# Altium schematic sheet USRP.SchDoc
size A
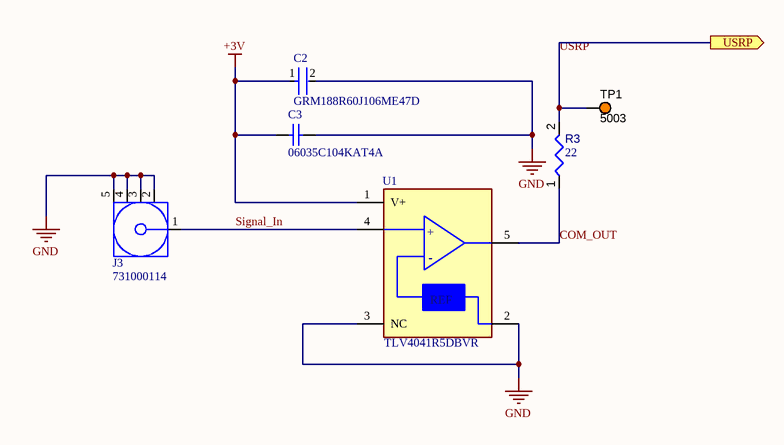
[diagram p0: USRP.SchDoc]

## Parts
C2  GRM188R60J106ME47D  [FP-GRM188-0_1-e0_2_0_55-IPC_A]
C3  06035C104KAT4A  [CAPC1608X90X35LL15T15]
J3  731000114  [MOLX-731000114_V]
R3  value 22  [RESC1609X50X30ML08T20]  (hidden comment: Resistor 22R +/-1% 0603 100 mW)
TP1  5003  [KSTN-5003]
U1  TLV4041R5DBVR  [FP-DBV0005A-IPC_C]

## Ports
USRP (out)

## Nets
+3V: C2.1 C3.2 U1.1(V+)
GND: C2.2 C3.1 J3.2 J3.3 J3.4 J3.5 U1.2(V-) U1.3(NC)
COM_OUT: R3.1 U1.5(OUT)
Signal_In: J3.1 U1.4(IN)
USRP: R3.2 TP1.1 ; port USRP

## Notes on the sheet
- (in symbol CMP-04896-000141-1) +; -; REF

## Library data of the parts
C2 = CMP-2006-02792-2: Chip Multilayer Ceramic Capacitors for General Purpose, 0603, 10uF, X5R, 15%, 20%, 6.3V; Packaging: Tape and Reel; Voltage Rating (DC): 6.3V; Width: 0.031inch; Termination: SMD/SMT; Dielectric: X5R; Package Quantity: 4000; Voltage Rating: 6.3V; Capacitance: 10uF; Case/Package: 0603; Min Operating Temperature: -55°C; Voltage: 6.3V; Length: 1.6mm; Thickness: 0.035inch; Lead Free: Lead Free; Depth: 0.8mm; Case Code (Imperial): 0603; Max Operating Temperature: 85°C; Material: Ceramic; Height: 0.8mm; Tolerance: 20%; Mount: Surface Mount; REACH SVHC: No SVHC; Radiation Hardening: No; Case Code (Metric): 1608
C3 = CMP-2006-04390-1: Manufacturer: AVX Interconnect / Elco; Part Number: 06035C104KAT4A
J3 = CMP-2000-05487-1: SMA Right-Angle PCB Jack Receptacle, Brass Body, Gold Plated, 50 Ohm, 5-Pin THD, RoHS, Tray; Manufacturer: Molex; Datasheet Version: 09/2016; Package Description: 5-Pin Through Hole Device, Body 14.8 x 6.35 mm, Pitch 2.54 mm; Datasheet URL: http://www.molex.com/webdocs/datasheets/pdf/en-us/0731000114_RF_COAX_CONNECTORS.pdf; Manufacturer URL: http://www.molex.com/; Package Reference: 731000114; Mounting Technology: ThroughHole; Package URL: http://www.molex.com/pdm_docs/sd/731000114_sd.pdf
R3 = CMP-009-00027-5: Chip Resistor, 22 Ohm, +/- 1%, 100 mW, -55 to 155 degC, 0603 (1608 Metric); Power: 100mW; Voltage Rating: 75V; Max Operating Temperature: 155°C; Min Operating Temperature: -55°C; Tolerance: 1%; RoHS Compliant: True; Mounting Technology: SM; Case/Package: 0603; Pins: 2
TP1 = CMP-002-00037-2: Test Point, Orange, Height 4.6 mm, Tail Length 3 mm, 1-Pin THD, RoHS; Manufacturer: Keystone; Colour: Orange; Packaging: Bulk; Package Description: 1-Pin Through Hole Device, Dia 2.54 mm; Pins: 1; Package Reference: 5003; Datasheet Version: Jun-15; Case/Package: 5003; Mounting Technology: TH; Connector Type: TestPoint; Diameter: 2.54mm; Contact Material: Bronze; Datasheet URL: http://keyelco.com/userAssets/file/M65p56.pdf; Manufacturer URL: http://www.keyelco.com/; Package Quantity: 10; Contact Plating: Tin; RoHS Compliant: True
U1 = CMP-04896-000141-1: LOW-POWER COMPARATOR WITH REFERE